# Altium schematic sheet Sheet10.SchDoc
size A4
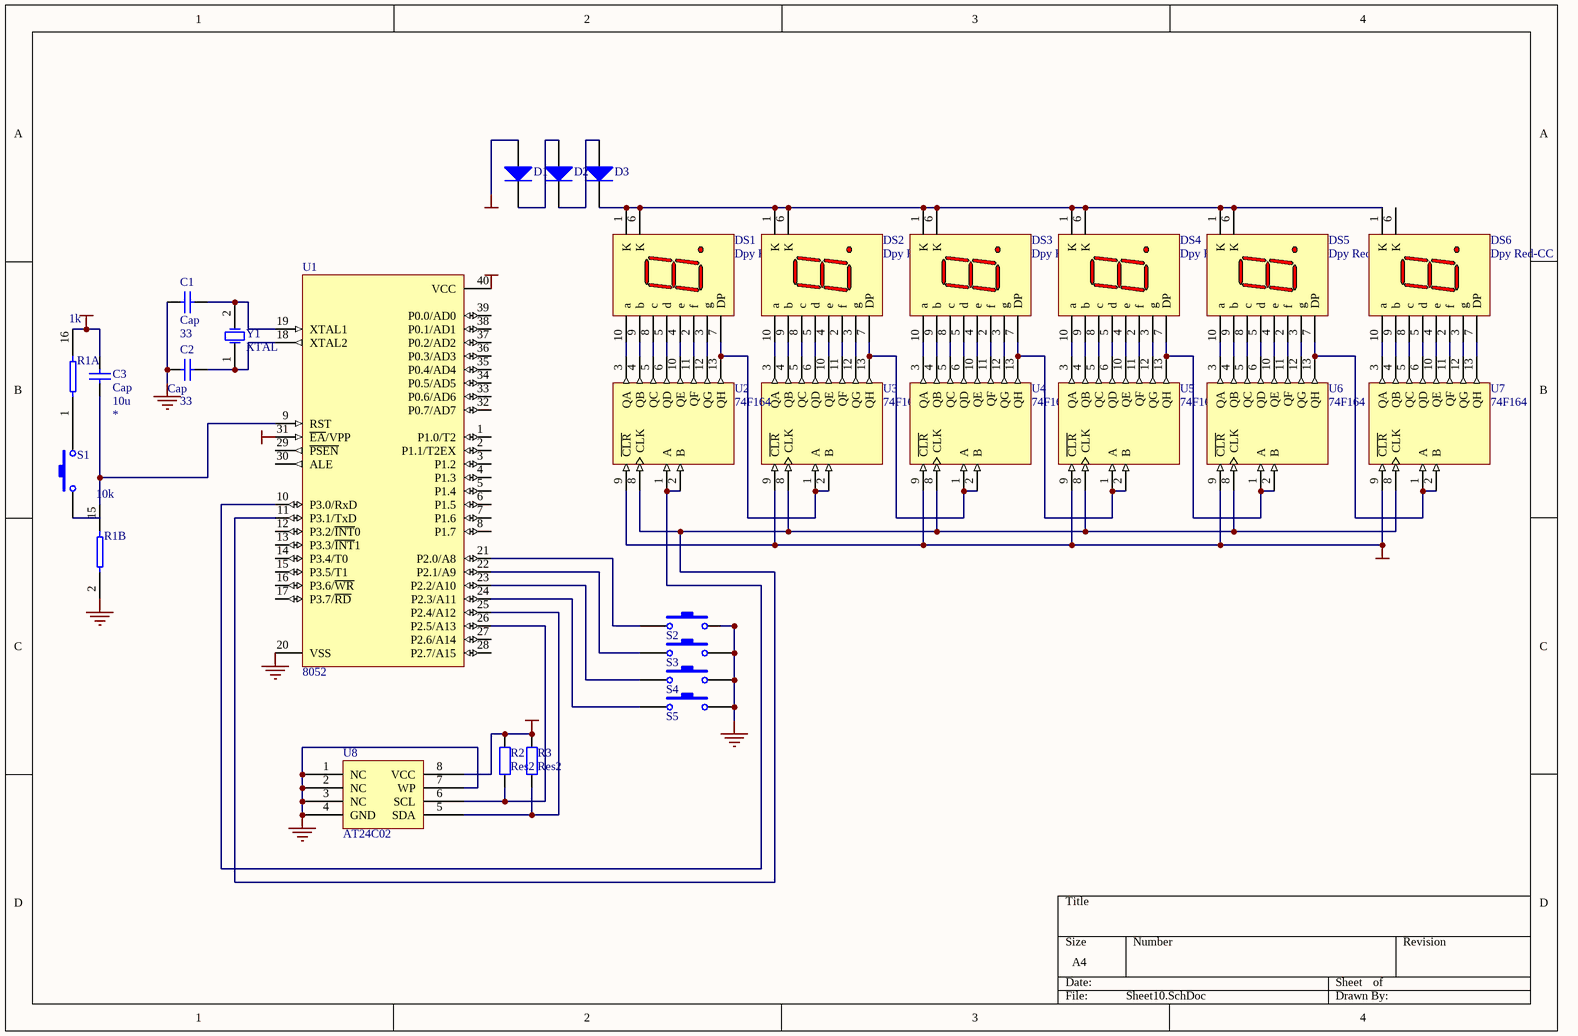
[diagram p0: Sheet10.SchDoc]

## Parts
C1  Cap  [RAD-0.3]
C2  Cap  [RAD-0.3]
C3  Cap  [RAD-0.3]
D1  Diode BAS21  [SO-G3/C2.5]  (value not drawn)
D2  Diode BAS21  [SO-G3/C2.5]  (value not drawn)
D3  Diode BAS21  [SO-G3/C2.5]  (value not drawn)
DS1  Dpy Red-CC  [LEDDIP-10/C5.08RHD]
DS2  Dpy Red-CC  [LEDDIP-10/C5.08RHD]
DS3  Dpy Red-CC  [LEDDIP-10/C5.08RHD]
DS4  Dpy Red-CC  [LEDDIP-10/C5.08RHD]
DS5  Dpy Red-CC  [LEDDIP-10/C5.08RHD]
DS6  Dpy Red-CC  [LEDDIP-10/C5.08RHD]
R1  Res Pack2  [DIP-16]  (value not drawn)  (parts A,B of 8)
R2  Res2  [AXIAL-0.4]
R3  Res2  [AXIAL-0.4]
S1  SW-PB  [SPST-2]  (value not drawn)
S2  SW-PB  [SPST-2]  (value not drawn)
S3  SW-PB  [SPST-2]  (value not drawn)
S4  SW-PB  [SPST-2]  (value not drawn)
S5  SW-PB  [SPST-2]  (value not drawn)
U1  8052  [SOT129-1]
U2  74F164  [DIP-14]
U3  74F164  [DIP-14]
U4  74F164  [DIP-14]
U5  74F164  [DIP-14]
U6  74F164  [DIP-14]
U7  74F164  [DIP-14]
U8  AT24C02
Y1  XTAL  [BCY-W2/D3.1]

## Nets
+5: D1.1(A) R2.2 R3.2 U1.31(~{EA}/VPP) U1.40(VCC) U8.8(VCC)
+5v: C3.2 R1.16
GND: C1.2 C2.2 R1.2 S2.2 S3.2 S4.2 S5.2 U1.20(VSS) U2.7(GND) U3.7(GND) U4.7(GND) U5.7(GND) U6.7(GND) U7.7(GND) U8.1(NC) U8.2(NC) U8.3(NC) U8.4(GND) U8.7(WP)
VCC: U2.9(~{CLR}) U2.14(VCC) U3.9(~{CLR}) U3.14(VCC) U4.9(~{CLR}) U4.14(VCC) U5.9(~{CLR}) U5.14(VCC) U6.9(~{CLR}) U6.14(VCC) U7.9(~{CLR}) U7.14(VCC)
NetC1_1: C1.1 U1.19(XTAL1) Y1.2(OSC2)
NetC2_1: C2.1 U1.18(XTAL2) Y1.1(OSC1)
NetC3_1: C3.1 R1.15 U1.9(RST)
NetD1_3: D1.3(K) D2.1(A)
NetD2_3: D2.3(K) D3.1(A)
NetD3_3: D3.3(K) DS1.1(K) DS1.6(K) DS2.1(K) DS2.6(K) DS3.1(K) DS3.6(K) DS4.1(K) DS4.6(K) DS5.1(K) DS5.6(K) DS6.1(K)
NetDS1_2: DS1.2(f) U2.11(QF)
NetDS1_3: DS1.3(g) U2.12(QG)
NetDS1_4: DS1.4(e) U2.10(QE)
NetDS1_5: DS1.5(d) U2.6(QD)
NetDS1_7: DS1.7(DP) U2.13(QH) U3.1(A) U3.2(B)
NetDS1_8: DS1.8(c) U2.5(QC)
NetDS1_9: DS1.9(b) U2.4(QB)
NetDS1_10: DS1.10(a) U2.3(QA)
NetDS2_2: DS2.2(f) U3.11(QF)
NetDS2_3: DS2.3(g) U3.12(QG)
NetDS2_4: DS2.4(e) U3.10(QE)
NetDS2_5: DS2.5(d) U3.6(QD)
NetDS2_7: DS2.7(DP) U3.13(QH) U4.1(A) U4.2(B)
NetDS2_8: DS2.8(c) U3.5(QC)
NetDS2_9: DS2.9(b) U3.4(QB)
NetDS2_10: DS2.10(a) U3.3(QA)
NetDS3_2: DS3.2(f) U4.11(QF)
NetDS3_3: DS3.3(g) U4.12(QG)
NetDS3_4: DS3.4(e) U4.10(QE)
NetDS3_5: DS3.5(d) U4.6(QD)
NetDS3_7: DS3.7(DP) U4.13(QH) U5.1(A) U5.2(B)
NetDS3_8: DS3.8(c) U4.5(QC)
NetDS3_9: DS3.9(b) U4.4(QB)
NetDS3_10: DS3.10(a) U4.3(QA)
NetDS4_2: DS4.2(f) U5.11(QF)
NetDS4_3: DS4.3(g) U5.12(QG)
NetDS4_4: DS4.4(e) U5.10(QE)
NetDS4_5: DS4.5(d) U5.6(QD)
NetDS4_7: DS4.7(DP) U5.13(QH) U6.1(A) U6.2(B)
NetDS4_8: DS4.8(c) U5.5(QC)
NetDS4_9: DS4.9(b) U5.4(QB)
NetDS4_10: DS4.10(a) U5.3(QA)
NetDS5_2: DS5.2(f) U6.11(QF)
NetDS5_3: DS5.3(g) U6.12(QG)
NetDS5_4: DS5.4(e) U6.10(QE)
NetDS5_5: DS5.5(d) U6.6(QD)
NetDS5_7: DS5.7(DP) U6.13(QH) U7.1(A) U7.2(B)
NetDS5_8: DS5.8(c) U6.5(QC)
NetDS5_9: DS5.9(b) U6.4(QB)
NetDS5_10: DS5.10(a) U6.3(QA)
NetDS6_2: DS6.2(f) U7.11(QF)
NetDS6_3: DS6.3(g) U7.12(QG)
NetDS6_4: DS6.4(e) U7.10(QE)
NetDS6_5: DS6.5(d) U7.6(QD)
NetDS6_7: DS6.7(DP) U7.13(QH)
NetDS6_8: DS6.8(c) U7.5(QC)
NetDS6_9: DS6.9(b) U7.4(QB)
NetDS6_10: DS6.10(a) U7.3(QA)
NetR1_1: R1.1 S1.2
NetR2_1: R2.1 U1.26(P2.5/A13) U8.6(SCL)
NetR3_1: R3.1 U1.25(P2.4/A12) U8.5(SDA)
NetS2_1: S2.1 U1.21(P2.0/A8)
NetS3_1: S3.1 U1.22(P2.1/A9)
NetS4_1: S4.1 U1.23(P2.2/A10)
NetS5_1: S5.1 U1.24(P2.3/A11)
NetU1_10: U1.10(P3.0/RxD) U2.1(A) U2.2(B)
NetU1_11: U1.11(P3.1/TxD) U2.8(CLK) U3.8(CLK) U4.8(CLK) U5.8(CLK) U6.8(CLK) U7.8(CLK)

Not connected (* = marked no-connect by the designer): DS6 6(K); S1 1; U1 1(P1.0/T2) 2(P1.1/T2EX) 3(P1.2) 4(P1.3) 5(P1.4) 6(P1.5) 7(P1.6) 8(P1.7) 12(P3.2/~{INT}0) 13(P3.3/~{INT}1) 14(P3.4/T0) 15(P3.5/T1) 16(P3.6/~{WR}) 17(P3.7/~{RD}) 27(P2.6/A14) 28(P2.7/A15) 29(~{PSEN}) 30(ALE) 32(P0.7/AD7) 33(P0.6/AD6) 34(P0.5/AD5) 35(P0.4/AD4) 36(P0.3/AD3) 37(P0.2/AD2) 38(P0.1/AD1) 39(P0.0/AD0)

## Notes on the sheet
- (in symbol Cap) 33; 10u
- (in symbol Res Pack2, part A) 1k
- (in symbol Res Pack2, part B) 10k

## Library data of the parts
C1-C3 = Cap: Capacitor; Published: 8-Jun-2000; LatestRevisionDate: 17-Jul-2002; LatestRevisionNote: Re-released for DXP Platform.; Publisher: Altium Limited
D1-D3 = Diode BAS21: Silicon Switching Diode for High-Speed, High-Voltage Switching; Note: Pin 2 is not connected and not drawn.; Published: 21-Mar-2003; DatasheetDocument: Oct-1999; PackageDocument: Sep-2001; PackageReference: SOT-23; Publisher: Altium Limited; ComponentLink1Description: Manufacturer Link; ComponentLink1URL: http://www.infineon.com/
DS1-DS6 = Dpy Red-CC: 7.62 mm Black Surface HER 7-Segment Display: CC, RH DP; MinimumIntensity: 360 ucd; Note: IF = 5 mA; Colour: High Efficiency Red (HER); Note: Pins 1 and 6 are redundant Cathodes.; Published: 8-Jun-2000; LatestRevisionDate: 17-Dec-2003; LatestRevisionNote: Schematic revised, PCB Footprint replaced.; DatasheetDocument: ##########; PackageDocument: 19-Feb-2002; PackageReference: A; Publisher: Altium Limited; ComponentLink1Description: Manufacturer Link; ComponentLink1URL: http://www.semiconductor.agilent.com/
R1 = Res Pack2: Isolated Resistor Network - Parts; Sim Note: Enter the Resistance value into parameter field.; Published: 24-Mar-1999; LatestRevisionDate: 17-Jul-2002; LatestRevisionNote: Re-released for DXP Platform.; Publisher: Altium Limited; Code_JEDEC: MO-001-AC
R2 R3 = Res2: Resistor; Published: 8-Jun-2000; LatestRevisionDate: 17-Jul-2002; LatestRevisionNote: Re-released for DXP Platform.; Publisher: Altium Limited
S1-S5 = SW-PB: Switch; Published: 24-Mar-1999; LatestRevisionDate: 17-Jul-2002; LatestRevisionNote: Re-released for DXP Platform.; Publisher: Altium Limited
U1 = P80C31SBPN: 80C51 8-Bit Microcontroller Family: 128 B RAM, ROMless, 2.7 V-5.5 V, Low Power, High Speed; Published: 21-May-2003; DatasheetDocument: 7-Aug-2000; PackageDocument: 07-Aug-2000; PackageReference: SOT129-1; Publisher: Altium Limited; ComponentLink1Description: Manufacturer Link; ComponentLink1URL: http://www-us2.semiconductors.philips.com/; Code_JEDEC: MO-015
U2-U7 = 74F164: 8-Bit Parallel-Out Serial Shift Register
U8 = Component_
Y1 = XTAL: Crystal Oscillator; Published: 8-Jun-2000; LatestRevisionDate: 17-Jul-2002; LatestRevisionNote: Re-released for DXP Platform.; PackageReference: R38; Publisher: Altium Limited